# EAGLE design Motoraufsatzsch (EAGLE 4.16)
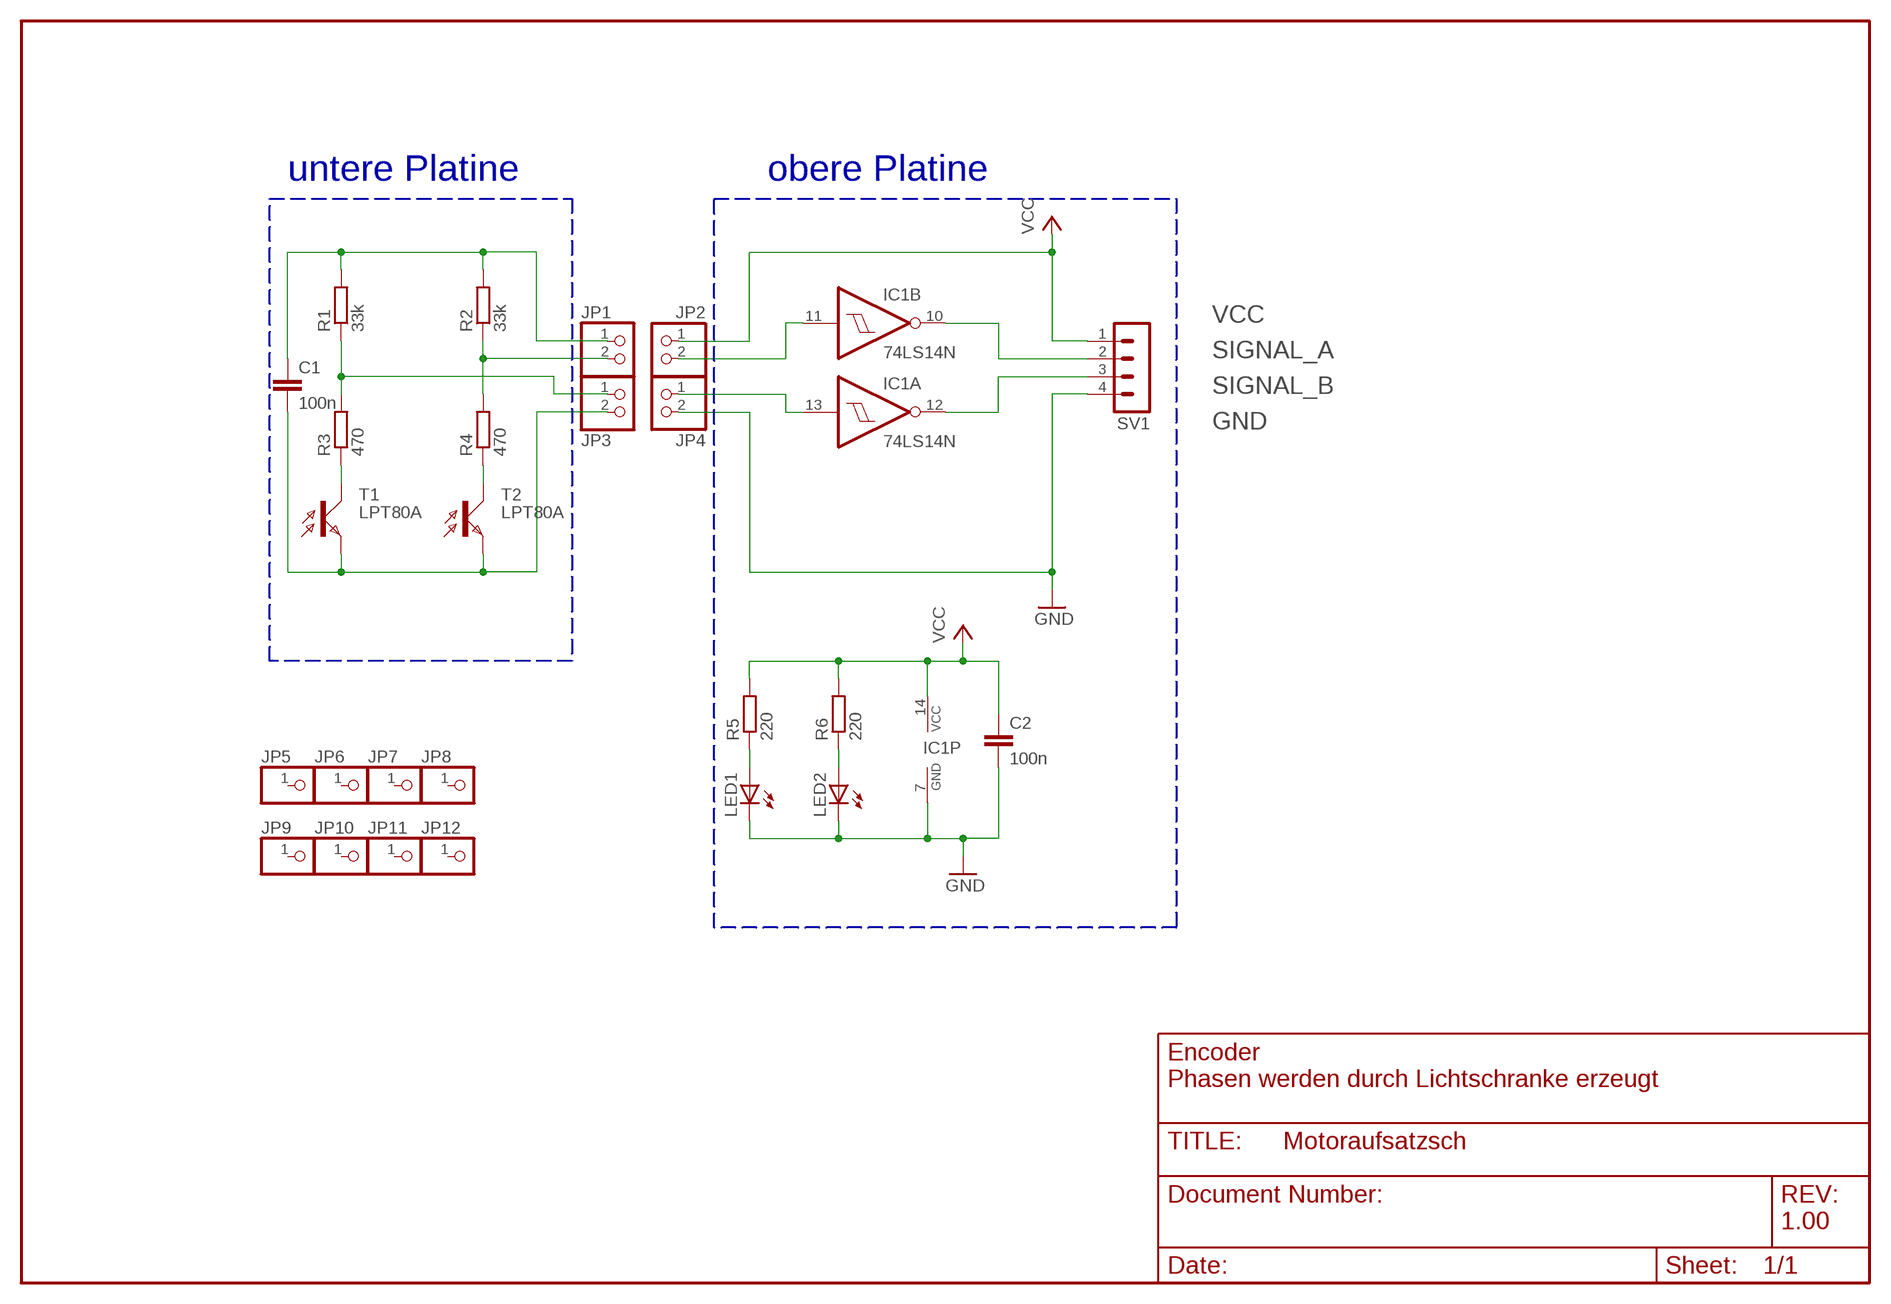
[diagram p0: schematic, sheet 1]

## Parts
C1  100n  C-EU025-025X050  [C025-025X050]
C2  100n  C-EU025-025X050  [C025-025X050]
IC1  74LS14N  [DIL14]
JP1  PINHD-1X2  [1X02]
JP2  PINHD-1X2  [1X02]
JP3  PINHD-1X2  [1X02]
JP4  PINHD-1X2  [1X02]
JP5  PINHD-1X1  [1X01]
JP6  PINHD-1X1  [1X01]
JP7  PINHD-1X1  [1X01]
JP8  PINHD-1X1  [1X01]
JP9  PINHD-1X1  [1X01]
JP10  PINHD-1X1  [1X01]
JP11  PINHD-1X1  [1X01]
JP12  PINHD-1X1  [1X01]
LED1  LEDIRL80A  [IRL80A]
LED2  LEDIRL80A  [IRL80A]
R1  33k  R-EU_0204/7  [0204/7]
R2  33k  R-EU_0204/7  [0204/7]
R3  470  R-EU_0204/7  [0204/7]
R4  470  R-EU_0204/7  [0204/7]
R5  220  R-EU_0204/7  [0204/7]
R6  220  R-EU_0204/7  [0204/7]
SV1  MA04-1  [MA04-1]
T1  LPT80A  [LPT80A]
T2  LPT80A  [LPT80A]

## Nets
GND: C2.2 IC1.7(P:GND) JP4.2 LED1.K(C) LED2.K(C) SV1.4
N$1: IC1.11(B:I) JP2.2
N$2: R4.1 T2.C
N$3: IC1.13(A:I) JP4.1
N$4: R3.1 T1.C
N$5: LED1.A R5.1
N$6: LED2.A R6.1
N$7: JP1.2 R2.1 R4.2
N$8: JP3.1 R1.1 R3.2
N$9: C1.2 JP3.2 T1.E T2.E
N$10: C1.1 JP1.1 R1.2 R2.2
SIGNAL_A: IC1.10(B:O) SV1.2
SIGNAL_B: IC1.12(A:O) SV1.3
VCC: C2.1 IC1.14(P:VCC) JP2.1 R5.2 R6.2 SV1.1
Unconnected: IC1.1(D:I) IC1.2(D:O) IC1.3(E:I) IC1.4(E:O) IC1.5(F:I) IC1.6(F:O) IC1.8(C:O) IC1.9(C:I) JP5.1 JP6.1 JP7.1 JP8.1 JP9.1 JP10.1 JP11.1 JP12.1

## Buses
B$1
B$2

## Notes on the sheet
- untere Platine | obere Platine
- Encoder
- Phasen werden durch Lichtschranke erzeugt
- 1.00

## Library data of the parts
C1 C2 = rcl:C-EU: CAPACITOR, European symbol
IC1 = 74xx-eu:74*14: Hex schmitt trigger INVERTER
JP1-JP4 = pinhead:PINHD-1X2: PIN HEADER
JP5-JP12 = pinhead:PINHD-1X1: PIN HEADER
LED1 LED2 = led:LED: LED OSRAM: - CHIPLED LG R971, LG N971, LY N971, LG Q971, LY Q971, LO R971, LY R971 LH N974, LH R974 LS Q976, LO Q976, LY Q976 LO Q996 - Hyper CHIPLED LW Q18S LB Q993, LB Q99A, LB R99A - SideLED LS A670, LO A670, LY A670, LG A670, LP A670 LB A673, LV A673, LT A673, LW A673 LH A674 LY A675 LS A676, LA A676, LO A676, LY A676, LW A676 LS A679, LY A679, LG A679 - Hyper Micro SIDELED® LS Y876, LA Y876, LO Y876, LY Y876 LT Y87S - SmartLED LW L88C, LW L88S LB L89C, LB L89S, LG L890 LS L89K, LO L89K, LY L89K LS L896, LA L896, LO L896, LY L896 - TOPLED LS T670, LO T670, LY T670, LG T670, LP T670 LSG T670, LSP T670, LSY T670, LOP T670, LYG T670 LG T671, LOG T671, LSG T671 LB T673, LV T673, LT T673, LW T673 LH T674 LS T676, LA T676, LO T676, LY T676, LB T676, LH T676, LSB T676, LW T676 LB T67C, LV T67C, LT T67C, LS T67K, LO T67K, LY T67K, LW E67C LS E67B, LA E67B, LO E67B, LY E67B, LB E67C, LV E67C, LT E67C LW T67C LS T679, LY T679, LG T679 LS T770, LO T770, LY T770, LG T770, LP T770 LB T773, LV T773, LT T773, LW T773 LH T774 LS E675, LA E675, LY E675, LS T675 LS T776, LA T776, LO T776, LY T776, LB T776 LHGB T686 LT T68C, LB T68C - Hyper Mini TOPLED® LB M676 - Mini TOPLED Santana® LG M470 LS M47K, LO M47K, LY M47K Source: http://www.osram.convergy.de/
R1-R6 = rcl:R-EU_: RESISTOR, European symbol
SV1 = con-lstb:MA04-1: PIN HEADER
T1 T2 = opto-trans-siemens:LPT80A: PHOTO TRANSISTOR

## Board
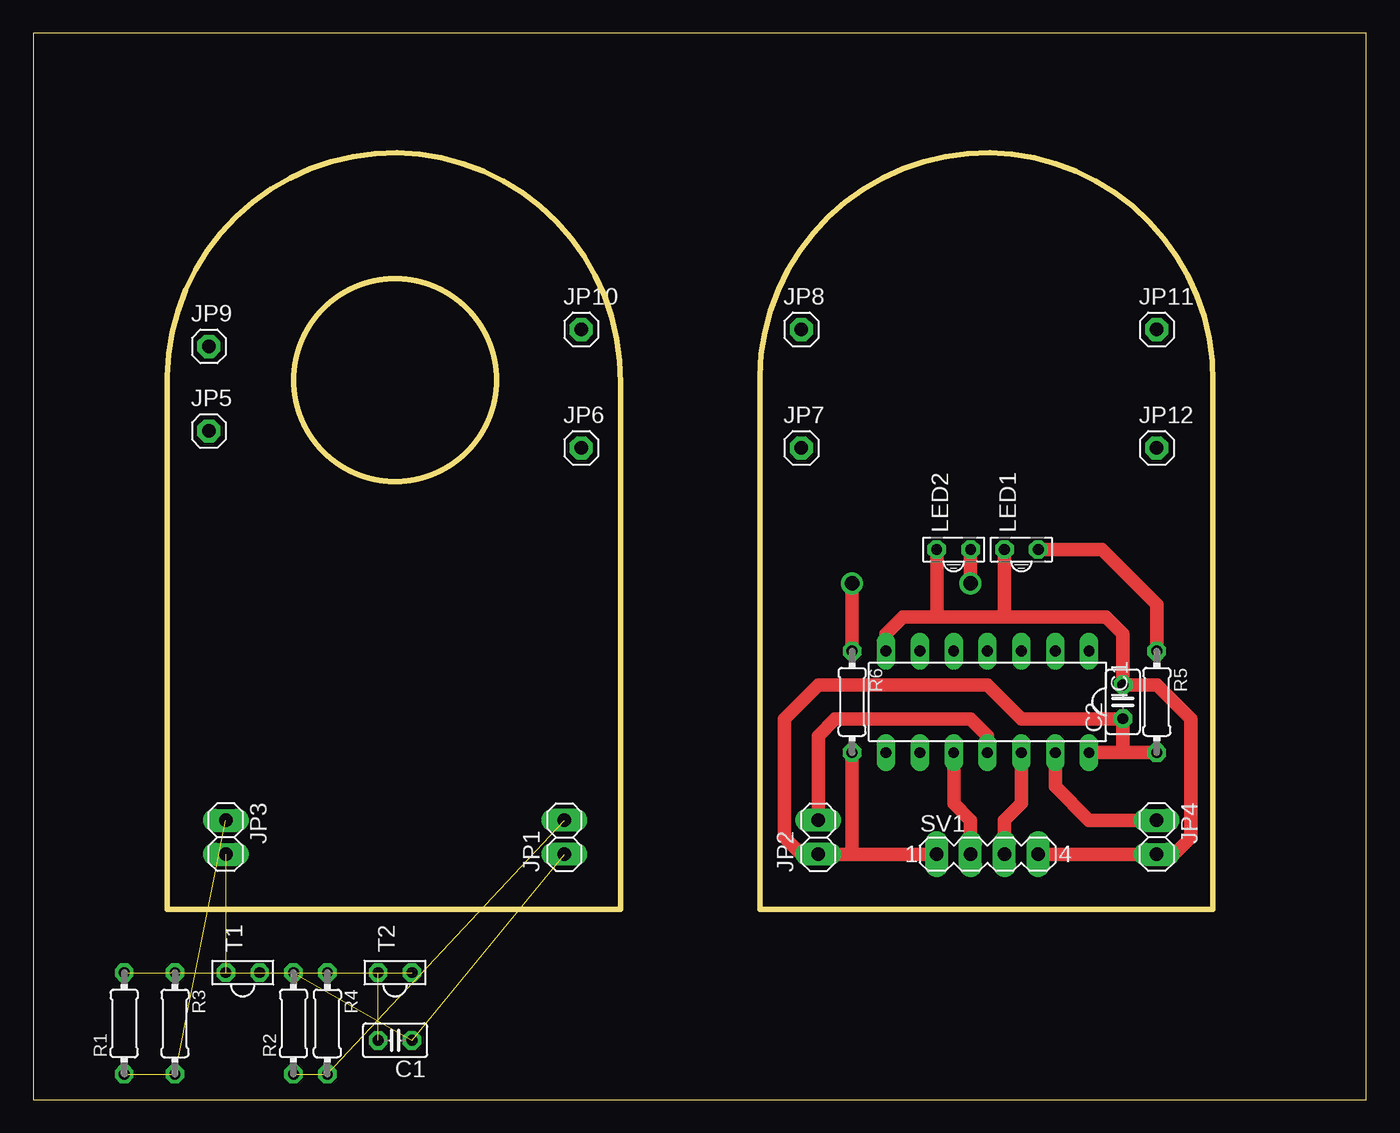
[diagram p1: board, top side]
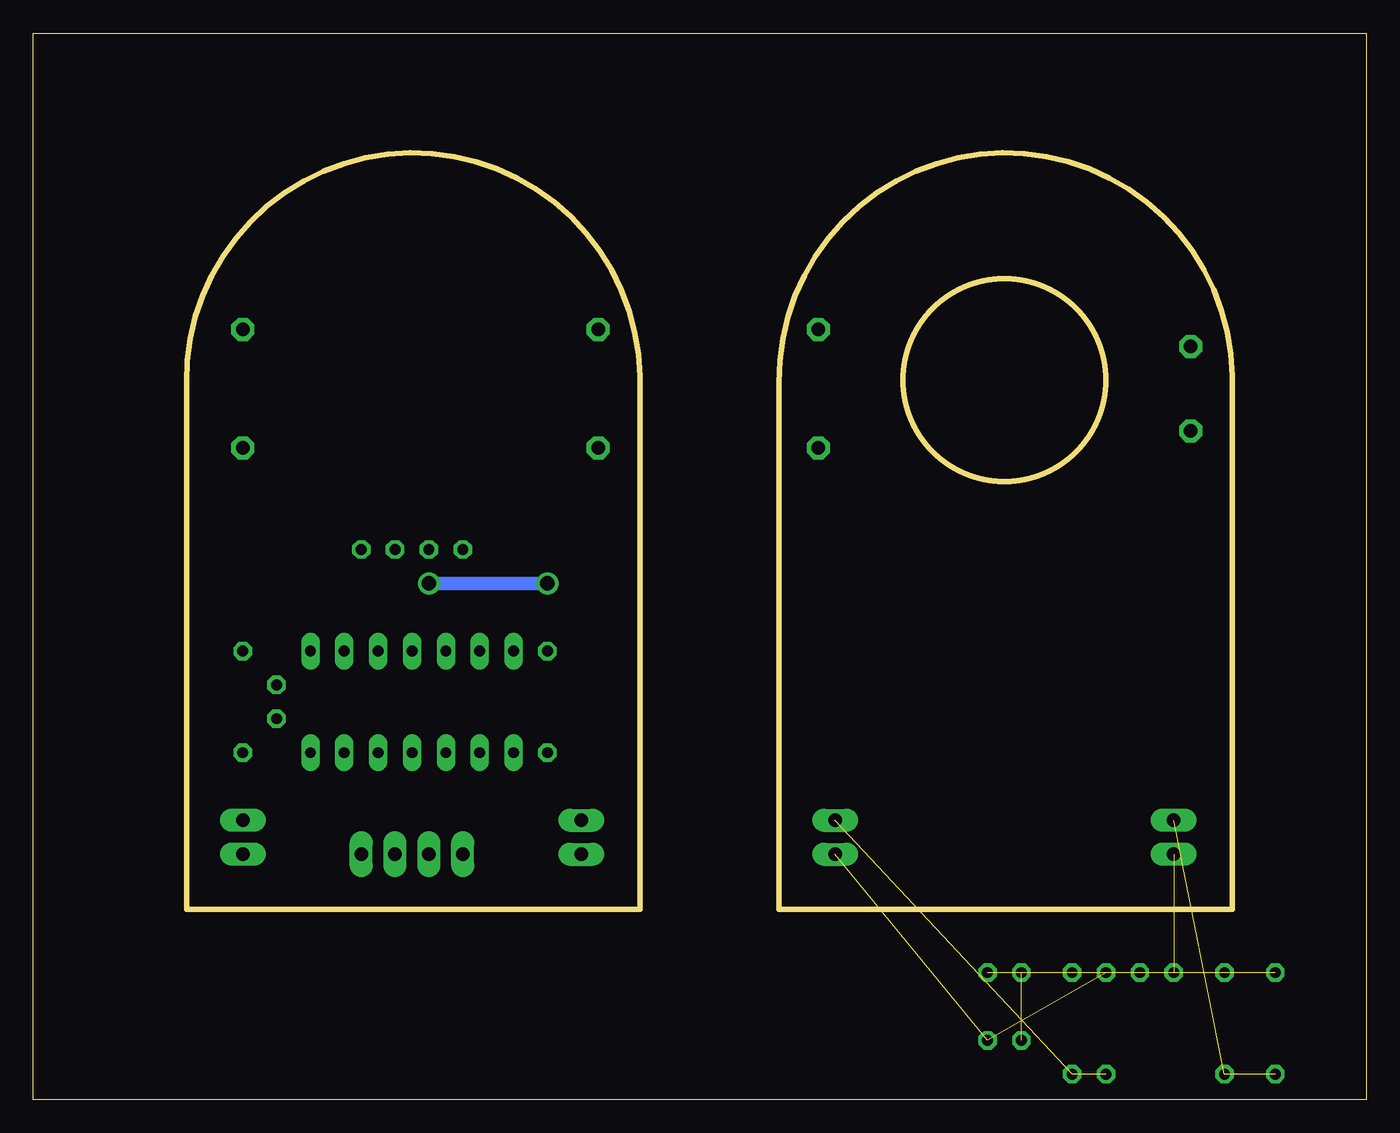
[diagram p2: board, bottom side, seen from below]

Size 100 x 80 mm. Coordinates in mm from the lower left corner, seen from the top.
Outline: 0,0 100,0 100,80 0,80 0,0
Outline: 10.05,54.28 arc-180 44.05,53.78 44.05,14.28 10.05,14.28 10.05,54.28
Outline: 54.5,54.28 arc-180 88.5,53.78 88.5,14.28 54.5,14.28 54.5,54.28
Outline: circle at 27.14,53.97 radius 7.59
Copper layers (1*16): Top 0.035mm / dielectric 1.5mm / Bottom 0.035mm
Design rules "default": minimum track width 40mil, minimum drill 24mil, track to track 8mil, track to pad 8mil, pad to pad 8mil, via to via 8mil, smd to smd 8mil, copper to edge 40mil, drill to drill 8mil, minimum pad ring 10mil, minimum via ring 8mil, stop-mask expansion 4mil, vias tented up to drill 0mil, thermal gap 10mil

### Footprints (pad centres in the part's own frame; a part is rotated, then mirrored left to right if it is on the bottom)
C025-025X050 = drill 0.813 octagon: 1 -1.27,0; 2 1.27,0
DIL14 = drill 0.813 long: 1 -7.62,-3.81; 2 -5.08,-3.81; 3 -2.54,-3.81; 4 0,-3.81; 5 2.54,-3.81; 6 5.08,-3.81; 7 7.62,-3.81; 8 7.62,3.81; 9 5.08,3.81; 10 2.54,3.81; 11 0,3.81; 12 -2.54,3.81; 13 -5.08,3.81; 14 -7.62,3.81
1X02 = drill 1.016 long: 1 -1.27,0; 2 1.27,0
1X01 = drill 1.016 octagon: 1 0,0
IRL80A = drill 0.813 octagon: A 0,-1.27; K 0,1.27
0204/7 = drill 0.813 octagon: 1 -3.81,0; 2 3.81,0
MA04-1 = drill 1.016 long: 1 -3.81,0; 2 -1.27,0; 3 1.27,0; 4 3.81,0
LPT80A = drill 0.813 octagon: C 0,-1.27; E 0,1.27

### Placement (x,y rotation side)
C1  27.14,4.44 180 top
C2  81.75,29.84 90 top
IC1  71.59,29.84 180 top
JP1  39.84,19.68 90 top
JP2  58.89,19.68 90 top
JP3  14.44,19.68 270 top
JP4  84.29,19.68 270 top
JP5  13.17,50.16 0 top
JP6  41.11,48.89 0 top
JP7  57.62,48.89 0 top
JP8  57.62,57.78 0 top
JP9  13.17,56.51 0 top
JP10  41.11,57.78 0 top
JP11  84.29,57.78 0 top
JP12  84.29,48.89 0 top
LED1  74.13,41.27 90 top
LED2  69.05,41.27 90 top
R1  6.82,5.71 90 top
R2  19.52,5.71 90 top
R3  10.63,5.71 270 top
R4  22.06,5.71 270 top
R5  84.29,29.84 270 top
R6  61.43,29.84 270 top
SV1  71.59,18.41 0 top
T1  15.71,9.52 90 top
T2  27.14,9.52 90 top

### Tracks (layer width: path | path; a pad name or v marks a point on that pad's centre or on a via)
GND
  Top 1.016: SV1.4 JP4.2 85.56,18.41 86.83,19.68 86.83,28.57 84.29,31.11 C2.2 81.75,34.92 80.48,36.19 72.86,36.19 | 67.78,36.19 LED2.K | 67.78,36.19 65.24,36.19 63.97,34.92 IC1.7 | 72.86,36.19 67.78,36.19 | 72.86,36.19 LED1.K
N$1
  Top 1.016: JP2.2 58.89,27.3 60.16,28.57 70.32,28.57 71.59,27.3 IC1.11
N$2  (1 unrouted)
N$3
  Top 1.016: IC1.13 76.67,23.49 79.21,20.95 JP4.1
N$4  (1 unrouted)
N$5
  Top 1.016: LED1.A 80.17,41.27 84.29,37.15 R5.1
N$6  (via drill 1.1)
  Top 1.016: v70.32,38.73 LED2.A | R6.1 v61.43,38.73
  Bottom 1.016: v61.43,38.73 v70.32,38.73
N$7  (2 unrouted)
N$8  (2 unrouted)
N$9  (3 unrouted)
N$10  (3 unrouted)
SIGNAL_A
  Top 1.016: SV1.2 70.32,20.95 69.05,22.22 IC1.10
SIGNAL_B
  Top 1.016: SV1.3 72.86,20.95 74.13,22.22 IC1.12
VCC
  Top 1.016: 61.43,18.41 JP2.1 | 61.43,18.41 SV1.1 57.62,18.41 56.35,19.68 56.35,28.57 58.89,31.11 71.59,31.11 74.13,28.57 C2.1 81.75,26.03 | 81.75,26.03 R5.2 | 61.43,18.41 R6.2 | 81.75,26.03 IC1.14